# Altium schematic sheet 3-CPU_SIGNAL.SchDoc
size D
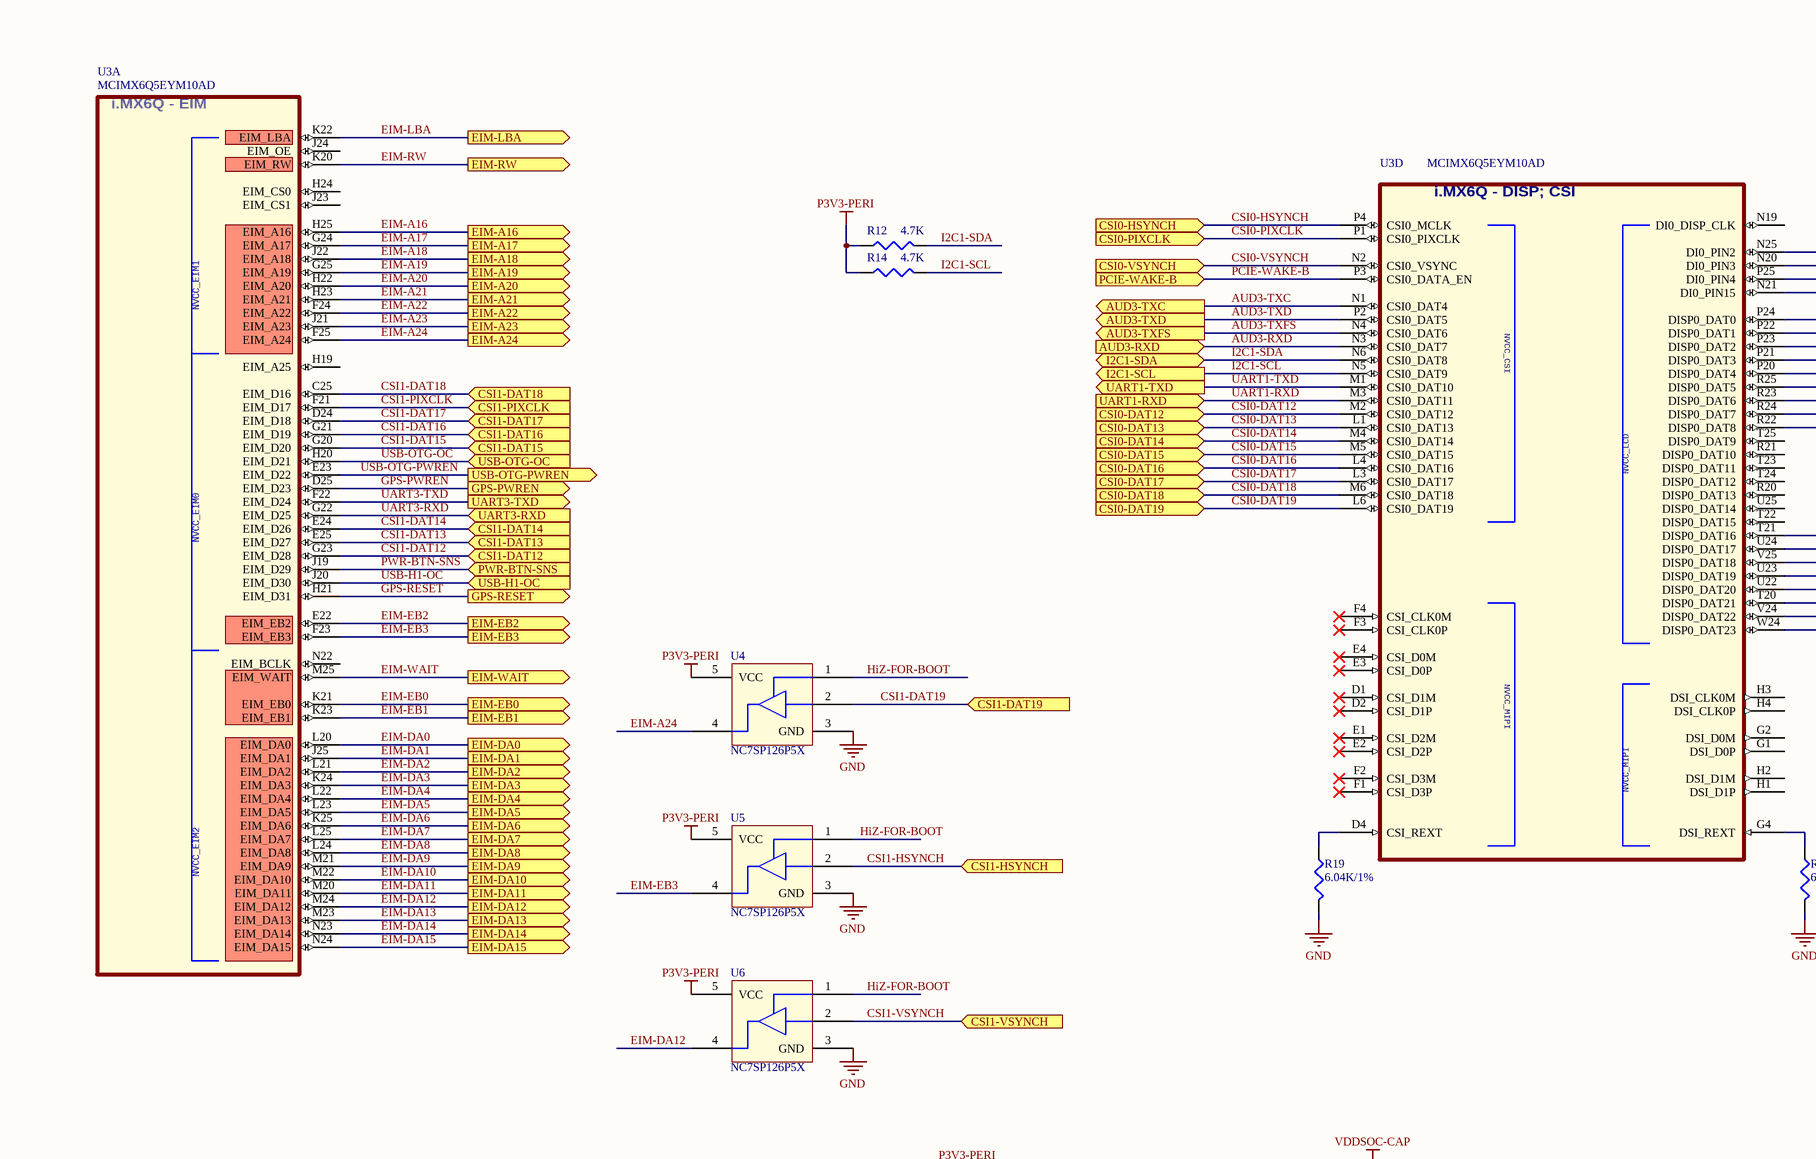
[diagram p0: 3-CPU_SIGNAL.SchDoc, top left]
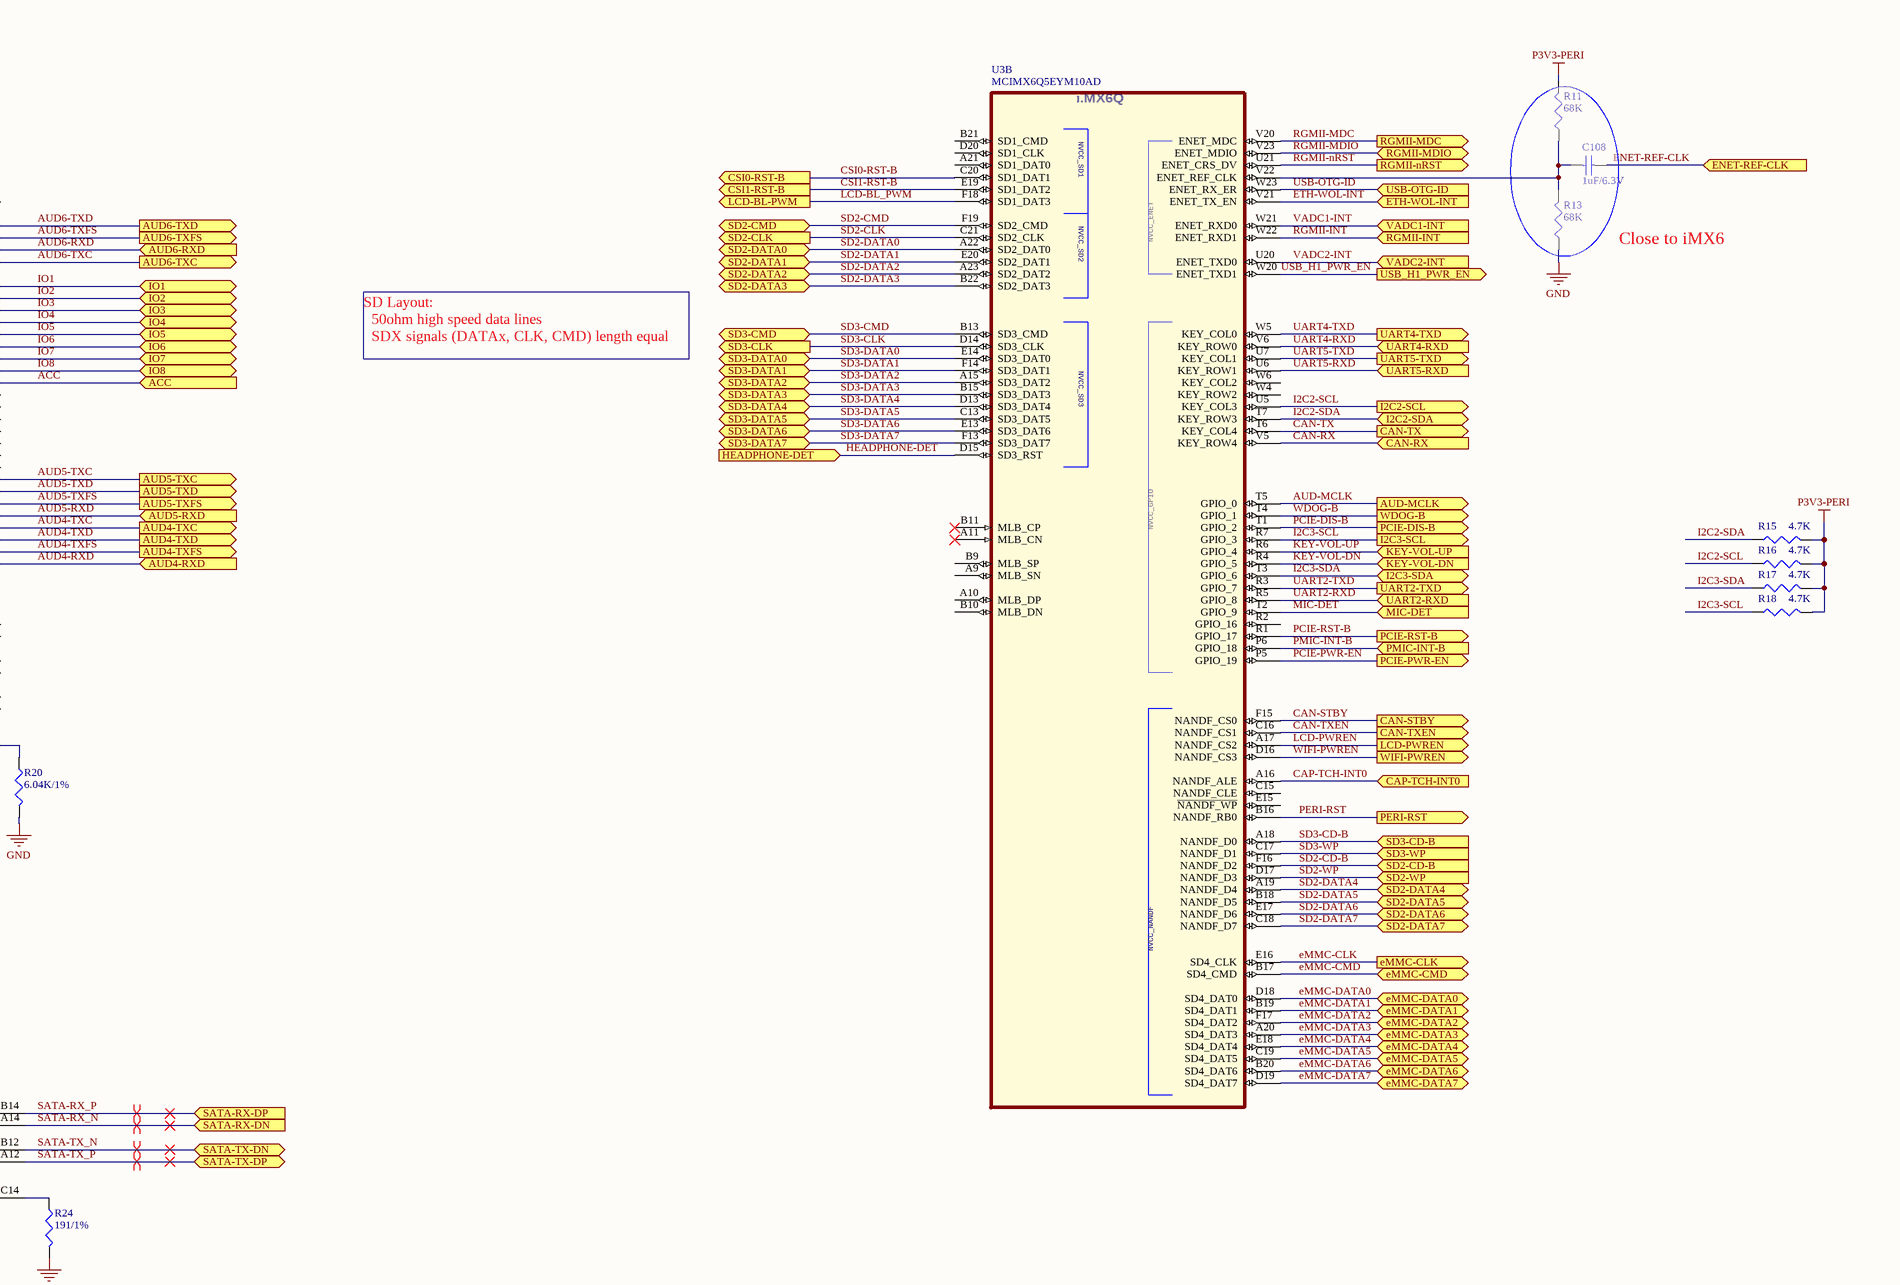
[diagram p1: 3-CPU_SIGNAL.SchDoc, top right]
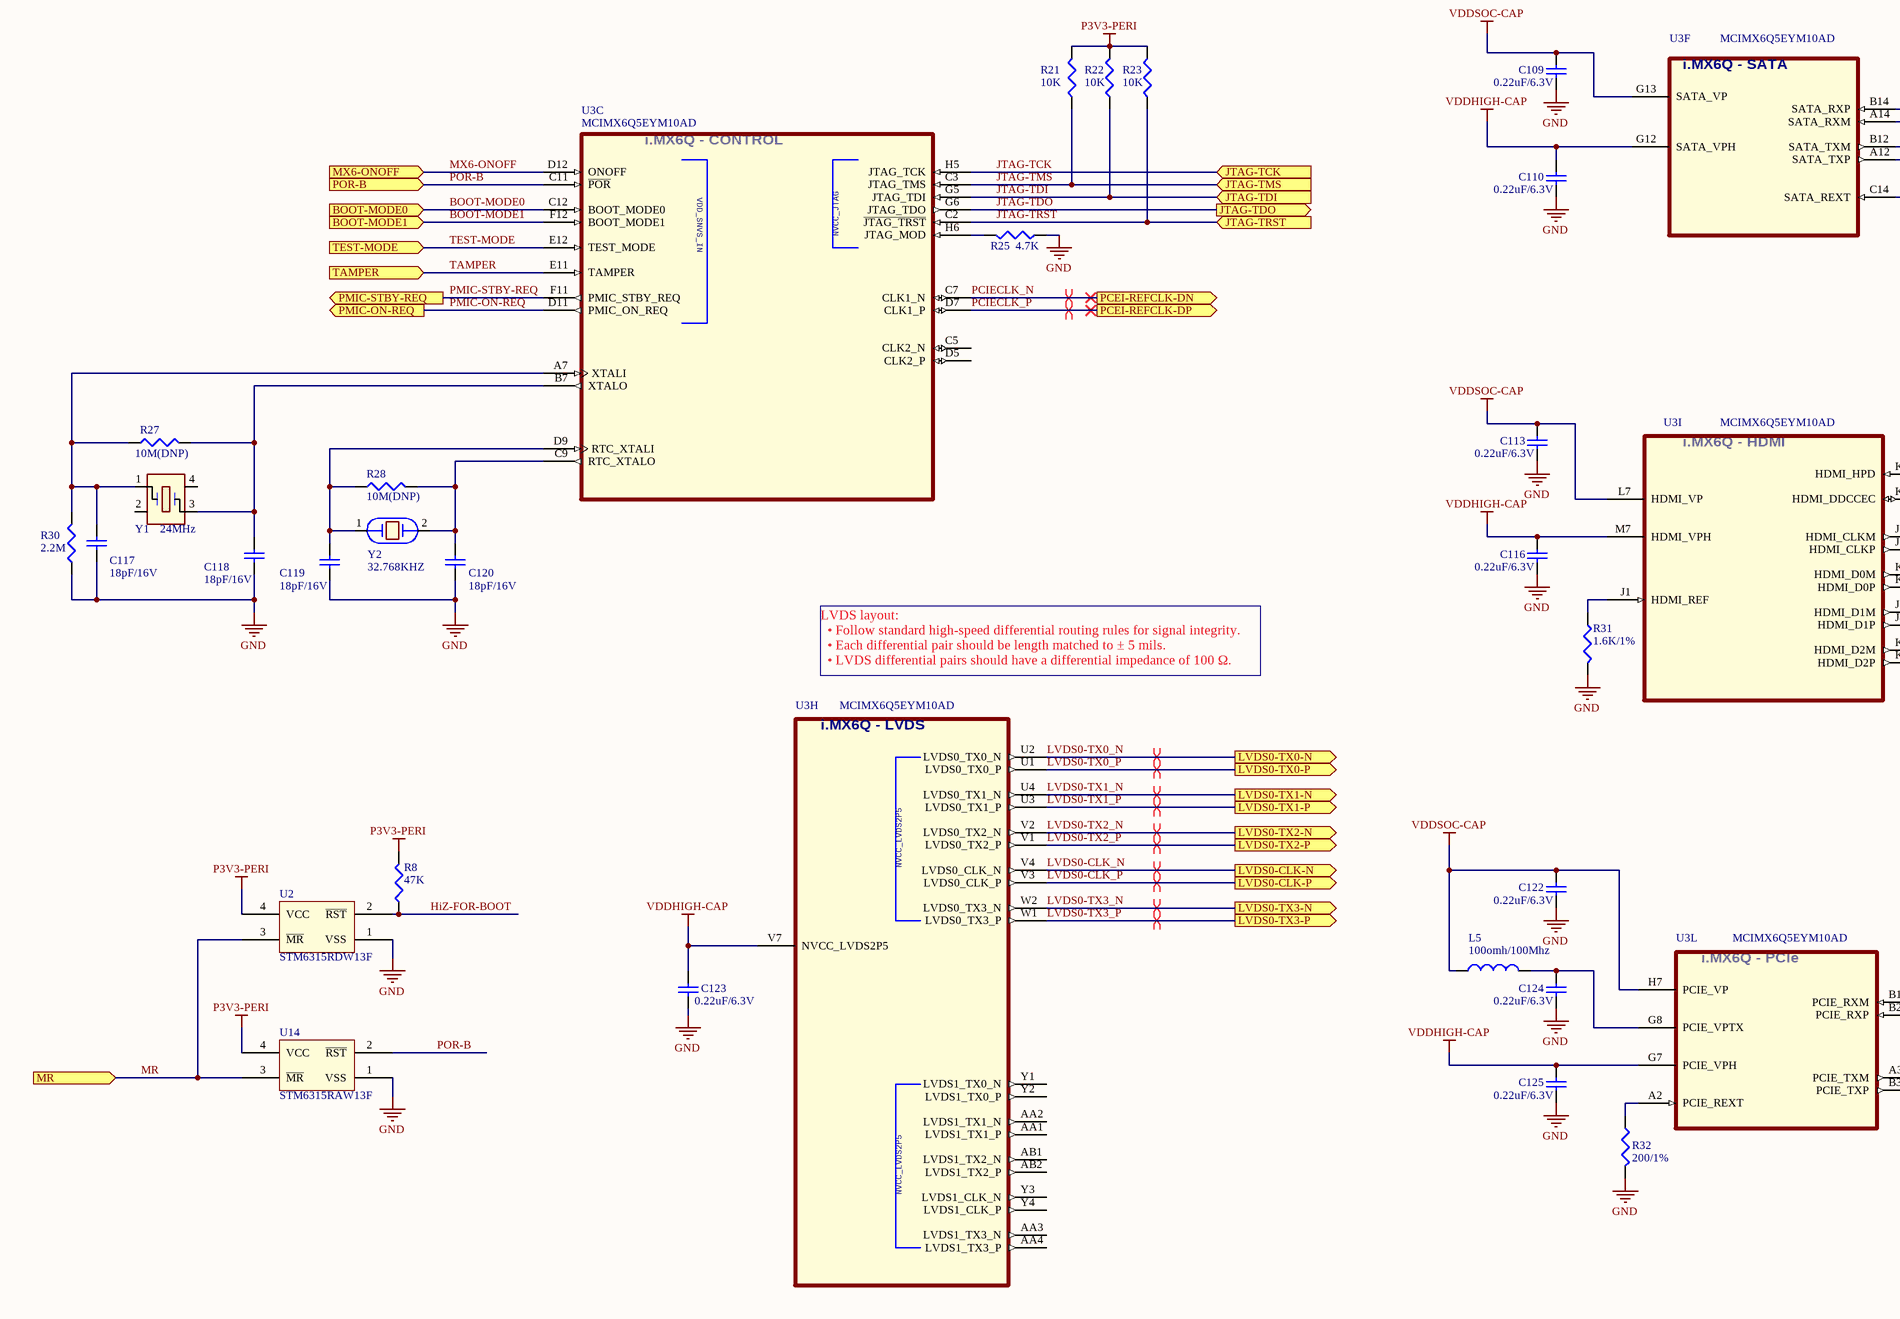
[diagram p2: 3-CPU_SIGNAL.SchDoc, bottom left]
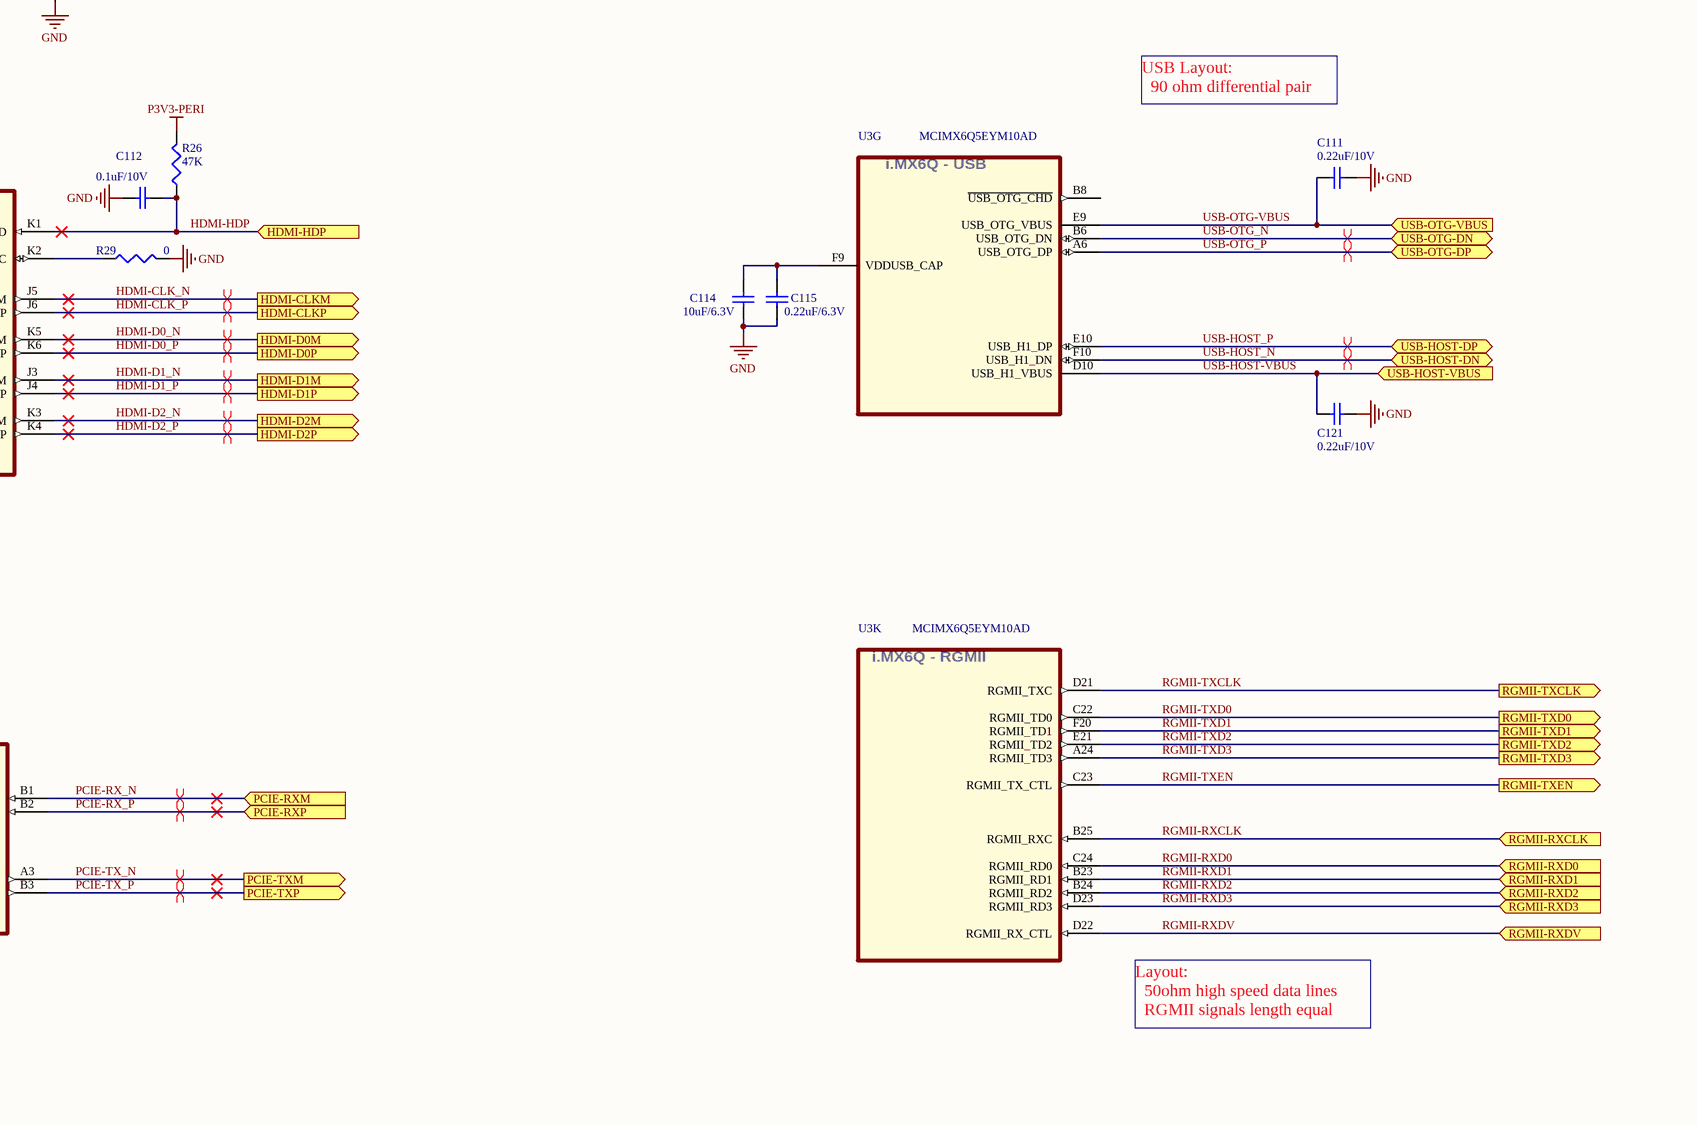
[diagram p3: 3-CPU_SIGNAL.SchDoc, bottom right]

## Parts
C108  1uF/6.3V  [0402_CC]
C109  0.22uF/6.3V  [0201_CC]
C110  0.22uF/6.3V  [0201_CC]
C111  0.22uF/10V  [0402_CC]
C112  0.1uF/10V  [0402_CC]
C113  0.22uF/6.3V  [0201_CC]
C114  10uF/6.3V  [0805_CC]
C115  0.22uF/6.3V  [0201_CC]
C116  0.22uF/6.3V  [0201_CC]
C117  18pF/16V  [0402_CC]
C118  18pF/16V  [0402_CC]
C119  18pF/16V  [0402_CC]
C120  18pF/16V  [0402_CC]
C121  0.22uF/10V  [0402_CC]
C122  0.22uF/6.3V  [0201_CC]
C123  0.22uF/6.3V  [0201_CC]
C124  0.22uF/6.3V  [0201_CC]
C125  0.22uF/6.3V  [0201_CC]
L5  100omh/100Mhz  [0603_CC]
R8  47K  [0402_CC]
R11  68K  [0402_CC]
R12  4.7K  [0402_CC]
R13  68K  [0402_CC]
R14  4.7K  [0402_CC]
R15  4.7K  [0402_CC]
R16  4.7K  [0402_CC]
R17  4.7K  [0402_CC]
R18  4.7K  [0402_CC]
R19  6.04K/1%  [0402_CC]
R20  6.04K/1%  [0402_CC]
R21  10K  [0402_CC]
R22  10K  [0402_CC]
R23  10K  [0402_CC]
R24  191/1%  [0402_CC]
R25  4.7K  [0402_CC]
R26  47K  [0402_CC]
R27  10M(DNP)  [0402_CC]
R28  10M(DNP)  [0402_CC]
R29  0  [0402_CC]
R30  2.2M  [0402_CC]
R31  1.6K/1%  [0402_CC]
R32  200/1%  [0402_CC]
U2  STM6315RDW13F  [SOT143-4]
U3  MCIMX6Q5EYM10AD  [FCPBGA]  (parts A,B,C,D,F,G,H,I,K,L of 12)
U4  NC7SP126P5X  [SC70]
U5  NC7SP126P5X  [SC70]
U6  NC7SP126P5X  [SC70]
U14  STM6315RAW13F  [SOT143-4]
Y1  24MHz  [XTAL4_SX_3225]
Y2  32.768KHZ  [XTAL2-3P2X1P5-SM]

## Ports
ACC (in), AUD3-RXD (in), AUD3-TXC (out), AUD3-TXD (out), AUD3-TXFS (out), AUD4-RXD (in), AUD4-TXC (out), AUD4-TXD (out), AUD4-TXFS (out), AUD5-RXD (in), AUD5-TXC (out), AUD5-TXD (out), AUD5-TXFS (out), AUD6-RXD (in), AUD6-TXC (out), AUD6-TXD (out), AUD6-TXFS (out), AUD-MCLK (out), BOOT-MODE0 (in), BOOT-MODE1 (in), CAN-RX (in), CAN-STBY (out), CAN-TX (out), CAN-TXEN (out), CAP-TCH-INT0 (in), CSI0-DAT12 (in), CSI0-DAT13 (in), CSI0-DAT14 (in), CSI0-DAT15 (in), CSI0-DAT16 (in), CSI0-DAT17 (in), CSI0-DAT18 (in), CSI0-DAT19 (in), CSI0-HSYNCH (in), CSI0-PIXCLK (in), CSI0-RST-B (out), CSI0-VSYNCH (in), CSI1-DAT12 (in), CSI1-DAT13 (in), CSI1-DAT14 (in), CSI1-DAT15 (in), CSI1-DAT16 (in), CSI1-DAT17 (in), CSI1-DAT18 (in), CSI1-DAT19 (in), CSI1-HSYNCH (in), CSI1-PIXCLK (in), CSI1-RST-B (out), CSI1-VSYNCH (in), EIM-A16 (out), EIM-A17 (out), EIM-A18 (out), EIM-A19 (out), EIM-A20 (out), EIM-A21 (out), EIM-A22 (out), EIM-A23 (out), EIM-A24 (out), EIM-DA0 (out), EIM-DA1 (out), EIM-DA2 (out), EIM-DA3 (out), EIM-DA4 (out), EIM-DA5 (out), EIM-DA6 (out), EIM-DA7 (out), EIM-DA8 (out), EIM-DA9 (out), EIM-DA10 (out), EIM-DA11 (out), EIM-DA12 (out), EIM-DA13 (out), EIM-DA14 (out), EIM-DA15 (out), EIM-EB0 (out), EIM-EB1 (out), EIM-EB2 (out), EIM-EB3 (out), EIM-LBA (out), EIM-RW (out), EIM-WAIT (out), eMMC-CLK (out), eMMC-CMD (bidir), eMMC-DATA0 (bidir), eMMC-DATA1 (bidir), eMMC-DATA2 (bidir), eMMC-DATA3 (bidir), eMMC-DATA4 (bidir), eMMC-DATA5 (bidir), eMMC-DATA6 (bidir), eMMC-DATA7 (bidir), ENET-REF-CLK (in), ETH-WOL-INT (in), GPS-PWREN (out), GPS-RESET (out), HDMI-CLKM (out), HDMI-CLKP (out), HDMI-D0M (out), HDMI-D0P (out), HDMI-D1M (out), HDMI-D1P (out), HDMI-D2M (out), HDMI-D2P (out), HDMI-HDP (in), HEADPHONE-DET (in), I2C1-SCL (out), I2C1-SDA (bidir), I2C2-SCL (out), I2C2-SDA (bidir), I2C3-SCL (out), I2C3-SDA (bidir), IO1 (bidir), IO2 (bidir), IO3 (bidir), IO4 (bidir), IO5 (bidir), IO6 (bidir), IO7 (bidir), IO8 (bidir), JTAG-TCK (in), JTAG-TDI (in), JTAG-TDO (out), JTAG-TMS (in), JTAG-TRST (in), KEY-VOL-DN (in), KEY-VOL-UP (in), LCD-BL-PWM (out), LCD-PWREN (out), LVDS0-CLK-N (out), LVDS0-CLK-P (out), LVDS0-TX0-N (out), LVDS0-TX0-P (out), LVDS0-TX1-N (out), LVDS0-TX1-P (out), LVDS0-TX2-N (out), LVDS0-TX2-P (out), LVDS0-TX3-N (out), LVDS0-TX3-P (out), MIC-DET (in), MR (in), MX6-ONOFF (in), PCEI-REFCLK-DN (out), PCEI-REFCLK-DP (out), PCIE-DIS-B (out), PCIE-PWR-EN (out), PCIE-RST-B (out), PCIE-RXM (in), PCIE-RXP (in), PCIE-TXM (out), PCIE-TXP (out), PCIE-WAKE-B (in), PERI-RST (out), PMIC-INT-B (in), PMIC-ON-REQ (out), PMIC-STBY-REQ (out), POR-B (in), PWR-BTN-SNS (in), RGMII-INT (in), RGMII-MDC (out), RGMII-MDIO (bidir), RGMII-nRST (out), RGMII-RXCLK (in), RGMII-RXD0 (in), RGMII-RXD1 (in), RGMII-RXD2 (in), RGMII-RXD3 (in), RGMII-RXDV (in), RGMII-TXCLK (out), RGMII-TXD0 (out), RGMII-TXD1 (out), RGMII-TXD2 (out), RGMII-TXD3 (out), RGMII-TXEN (out), SATA-RX-DN (in), SATA-RX-DP (in), SATA-TX-DN, SATA-TX-DP, SD2-CD-B (in), SD2-CLK (out), SD2-CMD (bidir), SD2-DATA0 (bidir), SD2-DATA1 (bidir), SD2-DATA2 (bidir), SD2-DATA3 (bidir), SD2-DATA4 (bidir), SD2-DATA5 (bidir), SD2-DATA6 (bidir), SD2-DATA7 (bidir), SD2-WP (in), SD3-CD-B (in), SD3-CLK (out), SD3-CMD (bidir), SD3-DATA0 (bidir), SD3-DATA1 (bidir), SD3-DATA2 (bidir), SD3-DATA3 (bidir), SD3-DATA4 (bidir), SD3-DATA5 (bidir), SD3-DATA6 (bidir), SD3-DATA7 (bidir), SD3-WP (in), TAMPER (in), TEST-MODE (in), UART1-RXD (in), UART1-TXD (out), UART2-RXD (in), UART2-TXD (out), UART3-RXD (in), UART3-TXD (out), UART4-RXD (in), UART4-TXD (out), UART5-RXD (in), UART5-TXD (out), USB-H1-OC (in), USB-HOST-DN (bidir), USB-HOST-DP (bidir), USB-HOST-VBUS (in), USB-OTG-DN (bidir), USB-OTG-DP (bidir), USB-OTG-ID (in), USB-OTG-OC (in), USB-OTG-PWREN (out), USB-OTG-VBUS (in), USB_H1_PWR_EN (out), VADC1-INT (in), VADC2-INT (in), WDOG-B (out), WIFI-PWREN (out)

## Nets
GND: C109.2 C110.2 C111.2 C112.1 C113.2 C114.2 C115.2 C116.2 C117.2 C118.2 C119.2 C120.2 C121.2 C122.2 C123.2 C124.2 C125.2 R13.2 R19.2 R20.2 R24.2 R25.1 R29.2 R30.1 R31.2 R32.2 U2.1(VSS) U4.3(GND) U5.3(GND) U6.3(GND) U14.1(VSS)
P3V3-PERI: R8.2 R11.1 R12.1 R14.1 R15.1 R16.1 R17.1 R18.1 R21.2 R22.2 R23.2 R26.2 U2.4(VCC) U4.5(VCC) U5.5(VCC) U6.5(VCC) U14.4(VCC)
VDDHIGH-CAP: C110.1 C116.1 C123.1 C125.1 U3.G7(PCIE_VPH) U3.G12(SATA_VPH) U3.M7(HDMI_VPH) U3.V7(NVCC_LVDS2P5)
VDDSOC-CAP: C109.1 C113.1 C122.1 L5.1 U3.G13(SATA_VP) U3.H7(PCIE_VP) U3.L7(HDMI_VP)
ACC: U3.R22(DISP0_DAT8) ; port ACC
AUD3-RXD: U3.N3(CSI0_DAT7) ; port AUD3-RXD
AUD3-TXC: U3.N1(CSI0_DAT4) ; port AUD3-TXC
AUD3-TXD: U3.P2(CSI0_DAT5) ; port AUD3-TXD
AUD3-TXFS: U3.N4(CSI0_DAT6) ; port AUD3-TXFS
AUD4-RXD: U3.W24(DISP0_DAT23) ; port AUD4-RXD
AUD4-TXC: U3.U22(DISP0_DAT20) ; port AUD4-TXC
AUD4-TXD: U3.T20(DISP0_DAT21) ; port AUD4-TXD
AUD4-TXFS: U3.V24(DISP0_DAT22) ; port AUD4-TXFS
AUD5-RXD: U3.U23(DISP0_DAT19) ; port AUD5-RXD
AUD5-TXC: U3.T21(DISP0_DAT16) ; port AUD5-TXC
AUD5-TXD: U3.U24(DISP0_DAT17) ; port AUD5-TXD
AUD5-TXFS: U3.V25(DISP0_DAT18) ; port AUD5-TXFS
AUD6-RXD: U3.P25(DI0_PIN4) ; port AUD6-RXD
AUD6-TXC: U3.N21(DI0_PIN15) ; port AUD6-TXC
AUD6-TXD: U3.N25(DI0_PIN2) ; port AUD6-TXD
AUD6-TXFS: U3.N20(DI0_PIN3) ; port AUD6-TXFS
AUD-MCLK: U3.T5(GPIO_0) ; port AUD-MCLK
BOOT-MODE0: U3.C12(BOOT_MODE0) ; port BOOT-MODE0
BOOT-MODE1: U3.F12(BOOT_MODE1) ; port BOOT-MODE1
CAN-RX: U3.V5(KEY_ROW4) ; port CAN-RX
CAN-STBY: U3.F15(NANDF_CS0) ; port CAN-STBY
CAN-TX: U3.T6(KEY_COL4) ; port CAN-TX
CAN-TXEN: U3.C16(NANDF_CS1) ; port CAN-TXEN
CAP-TCH-INT0: U3.A16(NANDF_ALE) ; port CAP-TCH-INT0
CSI0-DAT12: U3.M2(CSI0_DAT12) ; port CSI0-DAT12
CSI0-DAT13: U3.L1(CSI0_DAT13) ; port CSI0-DAT13
CSI0-DAT14: U3.M4(CSI0_DAT14) ; port CSI0-DAT14
CSI0-DAT15: U3.M5(CSI0_DAT15) ; port CSI0-DAT15
CSI0-DAT16: U3.L4(CSI0_DAT16) ; port CSI0-DAT16
CSI0-DAT17: U3.L3(CSI0_DAT17) ; port CSI0-DAT17
CSI0-DAT18: U3.M6(CSI0_DAT18) ; port CSI0-DAT18
CSI0-DAT19: U3.L6(CSI0_DAT19) ; port CSI0-DAT19
CSI0-HSYNCH: U3.P4(CSI0_MCLK) ; port CSI0-HSYNCH
CSI0-PIXCLK: U3.P1(CSI0_PIXCLK) ; port CSI0-PIXCLK
CSI0-RST-B: U3.C20(SD1_DAT1) ; port CSI0-RST-B
CSI0-VSYNCH: U3.N2(CSI0_VSYNC) ; port CSI0-VSYNCH
CSI1-DAT12: U3.G23(EIM_D28) ; port CSI1-DAT12
CSI1-DAT13: U3.E25(EIM_D27) ; port CSI1-DAT13
CSI1-DAT14: U3.E24(EIM_D26) ; port CSI1-DAT14
CSI1-DAT15: U3.G20(EIM_D20) ; port CSI1-DAT15
CSI1-DAT16: U3.G21(EIM_D19) ; port CSI1-DAT16
CSI1-DAT17: U3.D24(EIM_D18) ; port CSI1-DAT17
CSI1-DAT18: U3.C25(EIM_D16) ; port CSI1-DAT18
CSI1-DAT19: U4.2(A) ; port CSI1-DAT19
CSI1-HSYNCH: U5.2(A) ; port CSI1-HSYNCH
CSI1-PIXCLK: U3.F21(EIM_D17) ; port CSI1-PIXCLK
CSI1-RST-B: U3.E19(SD1_DAT2) ; port CSI1-RST-B
CSI1-VSYNCH: U6.2(A) ; port CSI1-VSYNCH
EIM-A16: U3.H25(EIM_A16) ; port EIM-A16
EIM-A17: U3.G24(EIM_A17) ; port EIM-A17
EIM-A18: U3.J22(EIM_A18) ; port EIM-A18
EIM-A19: U3.G25(EIM_A19) ; port EIM-A19
EIM-A20: U3.H22(EIM_A20) ; port EIM-A20
EIM-A21: U3.H23(EIM_A21) ; port EIM-A21
EIM-A22: U3.F24(EIM_A22) ; port EIM-A22
EIM-A23: U3.J21(EIM_A23) ; port EIM-A23
EIM-A24: U3.F25(EIM_A24) U4.4(Y) ; port EIM-A24
EIM-DA0: U3.L20(EIM_DA0) ; port EIM-DA0
EIM-DA1: U3.J25(EIM_DA1) ; port EIM-DA1
EIM-DA2: U3.L21(EIM_DA2) ; port EIM-DA2
EIM-DA3: U3.K24(EIM_DA3) ; port EIM-DA3
EIM-DA4: U3.L22(EIM_DA4) ; port EIM-DA4
EIM-DA5: U3.L23(EIM_DA5) ; port EIM-DA5
EIM-DA6: U3.K25(EIM_DA6) ; port EIM-DA6
EIM-DA7: U3.L25(EIM_DA7) ; port EIM-DA7
EIM-DA8: U3.L24(EIM_DA8) ; port EIM-DA8
EIM-DA9: U3.M21(EIM_DA9) ; port EIM-DA9
EIM-DA10: U3.M22(EIM_DA10) ; port EIM-DA10
EIM-DA11: U3.M20(EIM_DA11) ; port EIM-DA11
EIM-DA12: U3.M24(EIM_DA12) U6.4(Y) ; port EIM-DA12
EIM-DA13: U3.M23(EIM_DA13) ; port EIM-DA13
EIM-DA14: U3.N23(EIM_DA14) ; port EIM-DA14
EIM-DA15: U3.N24(EIM_DA15) ; port EIM-DA15
EIM-EB0: U3.K21(EIM_EB0) ; port EIM-EB0
EIM-EB1: U3.K23(EIM_EB1) ; port EIM-EB1
EIM-EB2: U3.E22(EIM_EB2) ; port EIM-EB2
EIM-EB3: U3.F23(EIM_EB3) U5.4(Y) ; port EIM-EB3
EIM-LBA: U3.K22(EIM_LBA) ; port EIM-LBA
EIM-RW: U3.K20(EIM_RW) ; port EIM-RW
EIM-WAIT: U3.M25(EIM_WAIT) ; port EIM-WAIT
eMMC-CLK: U3.E16(SD4_CLK) ; port eMMC-CLK
eMMC-CMD: U3.B17(SD4_CMD) ; port eMMC-CMD
eMMC-DATA0: U3.D18(SD4_DAT0) ; port eMMC-DATA0
eMMC-DATA1: U3.B19(SD4_DAT1) ; port eMMC-DATA1
eMMC-DATA2: U3.F17(SD4_DAT2) ; port eMMC-DATA2
eMMC-DATA3: U3.A20(SD4_DAT3) ; port eMMC-DATA3
eMMC-DATA4: U3.E18(SD4_DAT4) ; port eMMC-DATA4
eMMC-DATA5: U3.C19(SD4_DAT5) ; port eMMC-DATA5
eMMC-DATA6: U3.B20(SD4_DAT6) ; port eMMC-DATA6
eMMC-DATA7: U3.D19(SD4_DAT7) ; port eMMC-DATA7
ENET-REF-CLK: C108.2 ; port ENET-REF-CLK
ETH-WOL-INT: U3.V21(ENET_TX_EN) ; port ETH-WOL-INT
GPS-PWREN: U3.D25(EIM_D23) ; port GPS-PWREN
GPS-RESET: U3.H21(EIM_D31) ; port GPS-RESET
HDMI-CLK_N: U3.J5(HDMI_CLKM) ; port HDMI-CLKM
HDMI-CLK_P: U3.J6(HDMI_CLKP) ; port HDMI-CLKP
HDMI-D0_N: U3.K5(HDMI_D0M) ; port HDMI-D0M
HDMI-D0_P: U3.K6(HDMI_D0P) ; port HDMI-D0P
HDMI-D1_N: U3.J3(HDMI_D1M) ; port HDMI-D1M
HDMI-D1_P: U3.J4(HDMI_D1P) ; port HDMI-D1P
HDMI-D2_N: U3.K3(HDMI_D2M) ; port HDMI-D2M
HDMI-D2_P: U3.K4(HDMI_D2P) ; port HDMI-D2P
HDMI-HDP: C112.2 R26.1 U3.K1(HDMI_HPD) ; port HDMI-HDP
HEADPHONE-DET: U3.D15(SD3_RST) ; port HEADPHONE-DET
HiZ-FOR-BOOT: R8.1 U2.2(~{RST}) U4.1(OE) U5.1(OE) U6.1(OE)
I2C1-SCL: R14.2 U3.N5(CSI0_DAT9) ; port I2C1-SCL
I2C1-SDA: R12.2 U3.N6(CSI0_DAT8) ; port I2C1-SDA
I2C2-SCL: R16.2 U3.U5(KEY_COL3) ; port I2C2-SCL
I2C2-SDA: R15.2 U3.T7(KEY_ROW3) ; port I2C2-SDA
I2C3-SCL: R18.2 U3.R7(GPIO_3) ; port I2C3-SCL
I2C3-SDA: R17.2 U3.T3(GPIO_6) ; port I2C3-SDA
IO1: U3.P24(DISP0_DAT0) ; port IO1
IO2: U3.P22(DISP0_DAT1) ; port IO2
IO3: U3.P23(DISP0_DAT2) ; port IO3
IO4: U3.P21(DISP0_DAT3) ; port IO4
IO5: U3.P20(DISP0_DAT4) ; port IO5
IO6: U3.R25(DISP0_DAT5) ; port IO6
IO7: U3.R23(DISP0_DAT6) ; port IO7
IO8: U3.R24(DISP0_DAT7) ; port IO8
JTAG-TCK: U3.H5(JTAG_TCK) ; port JTAG-TCK
JTAG-TDI: R22.1 U3.G5(JTAG_TDI) ; port JTAG-TDI
JTAG-TDO: U3.G6(JTAG_TDO) ; port JTAG-TDO
JTAG-TMS: R21.1 U3.C3(JTAG_TMS) ; port JTAG-TMS
JTAG-TRST: R23.1 U3.C2(~{JTAG_TRST}) ; port JTAG-TRST
KEY-VOL-DN: U3.R4(GPIO_5) ; port KEY-VOL-DN
KEY-VOL-UP: U3.R6(GPIO_4) ; port KEY-VOL-UP
LCD-BL_PWM: U3.F18(SD1_DAT3) ; port LCD-BL-PWM
LCD-PWREN: U3.A17(NANDF_CS2) ; port LCD-PWREN
LVDS0-CLK_N: U3.V4(LVDS0_CLK_N) ; port LVDS0-CLK-N
LVDS0-CLK_P: U3.V3(LVDS0_CLK_P) ; port LVDS0-CLK-P
LVDS0-TX0_N: U3.U2(LVDS0_TX0_N) ; port LVDS0-TX0-N
LVDS0-TX0_P: U3.U1(LVDS0_TX0_P) ; port LVDS0-TX0-P
LVDS0-TX1_N: U3.U4(LVDS0_TX1_N) ; port LVDS0-TX1-N
LVDS0-TX1_P: U3.U3(LVDS0_TX1_P) ; port LVDS0-TX1-P
LVDS0-TX2_N: U3.V2(LVDS0_TX2_N) ; port LVDS0-TX2-N
LVDS0-TX2_P: U3.V1(LVDS0_TX2_P) ; port LVDS0-TX2-P
LVDS0-TX3_N: U3.W2(LVDS0_TX3_N) ; port LVDS0-TX3-N
LVDS0-TX3_P: U3.W1(LVDS0_TX3_P) ; port LVDS0-TX3-P
MIC-DET: U3.T2(GPIO_9) ; port MIC-DET
MR: U2.3(~{MR}) U14.3(~{MR}) ; port MR
MX6-ONOFF: U3.D12(ONOFF) ; port MX6-ONOFF
PCIE-DIS-B: U3.T1(GPIO_2) ; port PCIE-DIS-B
PCIE-PWR-EN: U3.P5(GPIO_19) ; port PCIE-PWR-EN
PCIE-RST-B: U3.R1(GPIO_17) ; port PCIE-RST-B
PCIE-RX_N: U3.B1(PCIE_RXM) ; port PCIE-RXM
PCIE-RX_P: U3.B2(PCIE_RXP) ; port PCIE-RXP
PCIE-TX_N: U3.A3(PCIE_TXM) ; port PCIE-TXM
PCIE-TX_P: U3.B3(PCIE_TXP) ; port PCIE-TXP
PCIE-WAKE-B: U3.P3(CSI0_DATA_EN) ; port PCIE-WAKE-B
PCIECLK_N: U3.C7(CLK1_N) ; port PCEI-REFCLK-DN
PCIECLK_P: U3.D7(CLK1_P) ; port PCEI-REFCLK-DP
PERI-RST: U3.B16(NANDF_RB0) ; port PERI-RST
PMIC-INT-B: U3.P6(GPIO_18) ; port PMIC-INT-B
PMIC-ON-REQ: U3.D11(PMIC_ON_REQ) ; port PMIC-ON-REQ
PMIC-STBY-REQ: U3.F11(PMIC_STBY_REQ) ; port PMIC-STBY-REQ
POR-B: U3.C11(~{POR}) U14.2(~{RST}) ; port POR-B
PWR-BTN-SNS: U3.J19(EIM_D29) ; port PWR-BTN-SNS
RGMII-INT: U3.W22(ENET_RXD1) ; port RGMII-INT
RGMII-MDC: U3.V20(ENET_MDC) ; port RGMII-MDC
RGMII-MDIO: U3.V23(ENET_MDIO) ; port RGMII-MDIO
RGMII-nRST: U3.U21(ENET_CRS_DV) ; port RGMII-nRST
RGMII-RXCLK: U3.B25(RGMII_RXC) ; port RGMII-RXCLK
RGMII-RXD0: U3.C24(RGMII_RD0) ; port RGMII-RXD0
RGMII-RXD1: U3.B23(RGMII_RD1) ; port RGMII-RXD1
RGMII-RXD2: U3.B24(RGMII_RD2) ; port RGMII-RXD2
RGMII-RXD3: U3.D23(RGMII_RD3) ; port RGMII-RXD3
RGMII-RXDV: U3.D22(RGMII_RX_CTL) ; port RGMII-RXDV
RGMII-TXCLK: U3.D21(RGMII_TXC) ; port RGMII-TXCLK
RGMII-TXD0: U3.C22(RGMII_TD0) ; port RGMII-TXD0
RGMII-TXD1: U3.F20(RGMII_TD1) ; port RGMII-TXD1
RGMII-TXD2: U3.E21(RGMII_TD2) ; port RGMII-TXD2
RGMII-TXD3: U3.A24(RGMII_TD3) ; port RGMII-TXD3
RGMII-TXEN: U3.C23(RGMII_TX_CTL) ; port RGMII-TXEN
SATA-RX_N: U3.A14(SATA_RXM) ; port SATA-RX-DN
SATA-RX_P: U3.B14(SATA_RXP) ; port SATA-RX-DP
SATA-TX_N: U3.B12(SATA_TXM) ; port SATA-TX-DN
SATA-TX_P: U3.A12(SATA_TXP) ; port SATA-TX-DP
SD2-CD-B: U3.F16(NANDF_D2) ; port SD2-CD-B
SD2-CLK: U3.C21(SD2_CLK) ; port SD2-CLK
SD2-CMD: U3.F19(SD2_CMD) ; port SD2-CMD
SD2-DATA0: U3.A22(SD2_DAT0) ; port SD2-DATA0
SD2-DATA1: U3.E20(SD2_DAT1) ; port SD2-DATA1
SD2-DATA2: U3.A23(SD2_DAT2) ; port SD2-DATA2
SD2-DATA3: U3.B22(SD2_DAT3) ; port SD2-DATA3
SD2-DATA4: U3.A19(NANDF_D4) ; port SD2-DATA4
SD2-DATA5: U3.B18(NANDF_D5) ; port SD2-DATA5
SD2-DATA6: U3.E17(NANDF_D6) ; port SD2-DATA6
SD2-DATA7: U3.C18(NANDF_D7) ; port SD2-DATA7
SD2-WP: U3.D17(NANDF_D3) ; port SD2-WP
SD3-CD-B: U3.A18(NANDF_D0) ; port SD3-CD-B
SD3-CLK: U3.D14(SD3_CLK) ; port SD3-CLK
SD3-CMD: U3.B13(SD3_CMD) ; port SD3-CMD
SD3-DATA0: U3.E14(SD3_DAT0) ; port SD3-DATA0
SD3-DATA1: U3.F14(SD3_DAT1) ; port SD3-DATA1
SD3-DATA2: U3.A15(SD3_DAT2) ; port SD3-DATA2
SD3-DATA3: U3.B15(SD3_DAT3) ; port SD3-DATA3
SD3-DATA4: U3.D13(SD3_DAT4) ; port SD3-DATA4
SD3-DATA5: U3.C13(SD3_DAT5) ; port SD3-DATA5
SD3-DATA6: U3.E13(SD3_DAT6) ; port SD3-DATA6
SD3-DATA7: U3.F13(SD3_DAT7) ; port SD3-DATA7
SD3-WP: U3.C17(NANDF_D1) ; port SD3-WP
TAMPER: U3.E11(TAMPER) ; port TAMPER
TEST-MODE: U3.E12(TEST_MODE) ; port TEST-MODE
UART1-RXD: U3.M3(CSI0_DAT11) ; port UART1-RXD
UART1-TXD: U3.M1(CSI0_DAT10) ; port UART1-TXD
UART2-RXD: U3.R5(GPIO_8) ; port UART2-RXD
UART2-TXD: U3.R3(GPIO_7) ; port UART2-TXD
UART3-RXD: U3.G22(EIM_D25) ; port UART3-RXD
UART3-TXD: U3.F22(EIM_D24) ; port UART3-TXD
UART4-RXD: U3.V6(KEY_ROW0) ; port UART4-RXD
UART4-TXD: U3.W5(KEY_COL0) ; port UART4-TXD
UART5-RXD: U3.U6(KEY_ROW1) ; port UART5-RXD
UART5-TXD: U3.U7(KEY_COL1) ; port UART5-TXD
USB-H1-OC: U3.J20(EIM_D30) ; port USB-H1-OC
USB-HOST-VBUS: C121.1 U3.D10(USB_H1_VBUS) ; port USB-HOST-VBUS
USB-HOST_N: U3.F10(USB_H1_DN) ; port USB-HOST-DN
USB-HOST_P: U3.E10(USB_H1_DP) ; port USB-HOST-DP
USB-OTG-ID: U3.W23(ENET_RX_ER) ; port USB-OTG-ID
USB-OTG-OC: U3.H20(EIM_D21) ; port USB-OTG-OC
USB-OTG-PWREN: U3.E23(EIM_D22) ; port USB-OTG-PWREN
USB-OTG-VBUS: C111.1 U3.E9(USB_OTG_VBUS) ; port USB-OTG-VBUS
USB-OTG_N: U3.B6(USB_OTG_DN) ; port USB-OTG-DN
USB-OTG_P: U3.A6(USB_OTG_DP) ; port USB-OTG-DP
USB_H1_PWR_EN: U3.W20(ENET_TXD1) ; port USB_H1_PWR_EN
VADC1-INT: U3.W21(ENET_RXD0) ; port VADC1-INT
VADC2-INT: U3.U20(ENET_TXD0) ; port VADC2-INT
WDOG-B: U3.T4(GPIO_1) ; port WDOG-B
WIFI-PWREN: U3.D16(NANDF_CS3) ; port WIFI-PWREN
NetC108_1: C108.1 R11.2 R13.1 U3.V22(ENET_REF_CLK)
NetC114_1: C114.1 C115.1 U3.F9(VDDUSB_CAP)
NetC117_1: C117.1 R27.1 R30.2 U3.A7(XTALI) Y1.1
NetC118_1: C118.1 R27.2 U3.B7(XTALO) Y1.3
NetC119_1: C119.1 R28.1 U3.D9(RTC_XTALI) Y2.1
NetC120_1: C120.1 R28.2 U3.C9(RTC_XTALO) Y2.2
NetC124_1: C124.1 L5.2 U3.G8(PCIE_VPTX)
NetR19_1: R19.1 U3.D4(CSI_REXT)
NetR20_1: R20.1 U3.G4(DSI_REXT)
NetR24_1: R24.1 U3.C14(SATA_REXT)
NetR25_2: R25.2 U3.H6(JTAG_MOD)
NetR29_1: R29.1 U3.K2(HDMI_DDCCEC)
NetR31_1: R31.1 U3.J1(HDMI_REF)
NetR32_1: R32.1 U3.A2(PCIE_REXT)

Not connected (* = marked no-connect by the designer): U3 A9(MLB_SN) A10(MLB_DP) A11(MLB_CN)* A21(SD1_DAT0) AA1(LVDS1_TX1_P) AA2(LVDS1_TX1_N) AA3(LVDS1_TX3_N) AA4(LVDS1_TX3_P) AB1(LVDS1_TX2_N) AB2(LVDS1_TX2_P) B8(~{USB_OTG_CHD}) B9(MLB_SP) B10(MLB_DN) B11(MLB_CP)* B21(SD1_CMD) C5(CLK2_N) C15(NANDF_CLE) D1(CSI_D1M)* D2(CSI_D1P)* D5(CLK2_P) D20(SD1_CLK) E1(CSI_D2M)* E2(CSI_D2P)* E3(CSI_D0P)* E4(CSI_D0M)* E15(~{NANDF_WP}) F1(CSI_D3P)* F2(CSI_D3M)* F3(CSI_CLK0P)* F4(CSI_CLK0M)* G1(DSI_D0P) G2(DSI_D0M) H1(DSI_D1P) H2(DSI_D1M) H3(DSI_CLK0M) H4(DSI_CLK0P) H19(EIM_A25) H24(EIM_CS0) J23(EIM_CS1) J24(EIM_OE) N19(DI0_DISP_CLK) N22(EIM_BCLK) R2(GPIO_16) R20(DISP0_DAT13) R21(DISP0_DAT10) T22(DISP0_DAT15) T23(DISP0_DAT11) T24(DISP0_DAT12) T25(DISP0_DAT9) U25(DISP0_DAT14) W4(KEY_ROW2) W6(KEY_COL2) Y1(LVDS1_TX0_N) Y2(LVDS1_TX0_P) Y3(LVDS1_CLK_N) Y4(LVDS1_CLK_P); Y1 2 4

## Layout directives
differential pair: HDMI-CLK_N, HDMI-CLK_P, HDMI-D0_N, HDMI-D0_P, HDMI-D1_N, HDMI-D1_P, HDMI-D2_N, HDMI-D2_P, LVDS0-CLK_N, LVDS0-CLK_P, LVDS0-TX0_N, LVDS0-TX0_P, LVDS0-TX1_N, LVDS0-TX1_P, LVDS0-TX2_N, LVDS0-TX2_P, LVDS0-TX3_N, LVDS0-TX3_P, PCIE-RX_N, PCIE-RX_P, PCIE-TX_N, PCIE-TX_P, PCIECLK_N, PCIECLK_P, SATA-RX_N, SATA-RX_P, SATA-TX_N, SATA-TX_P, USB-HOST_N, USB-HOST_P, USB-OTG_N, USB-OTG_P

## Notes on the sheet
- Close to iMX6
- SD Layout:
  50ohm high speed data lines
  SDX signals (DATAx, CLK, CMD) length equal
- USB Layout:
  90 ohm differential pair
- LVDS layout:
  • Follow standard high-speed differential routing rules for signal integrity.
  • Each differential pair should be length matched to ± 5 mils.
  • LVDS differential pairs should have a differential impedance of 100 Ω.
- Layout:
  50ohm high speed data lines
  RGMII signals length equal
- (in symbol PCIMX6Q6VV1A, part A) i.MX6Q - EIM
- (in symbol PCIMX6Q6VV1A, part B) i.MX6Q
- (in symbol PCIMX6Q6VV1A, part C) i.MX6Q - CONTROL
- (in symbol PCIMX6Q6VV1A, part D) i.MX6Q - DISP; CSI
- (in symbol PCIMX6Q6VV1A, part F) i.MX6Q - SATA
- (in symbol PCIMX6Q6VV1A, part G) i.MX6Q - USB
- (in symbol PCIMX6Q6VV1A, part H) i.MX6Q - LVDS
- (in symbol PCIMX6Q6VV1A, part I) i.MX6Q - HDMI
- (in symbol PCIMX6Q6VV1A, part K) i.MX6Q - RGMII
- (in symbol PCIMX6Q6VV1A, part L) i.MX6Q - PCIe

## Library data of the parts
C108-C125 = Cap: Capacitor; Published: 8-Jun-2000; LatestRevisionDate: 17-Jul-2002; LatestRevisionNote: Re-released for DXP Platform.; PackageReference: RAD-0.3; Publisher: Altium Limited; PackageDescription: Radial Cap, Thru-Hole; 2 Leads; 0.3 in Pin Spacing
L5 = Inductor: Code_IEC: 1005; Published: 8-Jun-2000; LatestRevisionDate: 29-May-2009; LatestRevisionNote: IPC-7351 Footprint Added.; PackageReference: 0402-A; Publisher: Altium Limited; PackageDescription: Chip Inductor; Code_JEITA: 0402
R8 R11-R32 = Res3: Resistor; Published: 8-Jun-2000; LatestRevisionDate: 29-May-2009; LatestRevisionNote: IPC-7351 Footprint Added.; PackageReference: J1-0603; Publisher: Altium Limited; PackageDescription: Chip Resistor
U2 U14 = STM6315
U3 = PCIMX6Q6VV1A: IC MCU MX6QUAD ARM CORTEX-A9 FCPBGA624; CAD_APPROVED: Yes; MFG_PN01: MCIMX6Q6AVT10AC; MFG_NAME01: FREESCALE SEMICONDUCTOR; AGILE_PN: 344-01218; CLASS: IC; HEIGHT: 2.16MM; ROHS: Yes
Y1 = XTAL_13Y_A: XTAL 24MHZ -- 3.2X2.5MM SMT; CLASS: IC; CAD_APPROVED: Yes; MFG_PN01: XTL571300LLI24.000-10TR; MFG_NAME01: SIWARD INTERNATIONAL INC; AGILE_PN: 230-76455; HEIGHT: 0.8MM; ROHS: Yes
Y2 = XTAL: XTAL 32.768KHZ 12.5PF 20PPM 3.2X1.5MM SMT; CLASS: IC; AGILE_PN: 230-77653; MFG_NAME01: Abracon Corporation; MFG_PN01: ABS07-32.768KHZ-T; CAD_APPROVED: Yes; ROHS: Yes; HEIGHT: 0.9MM